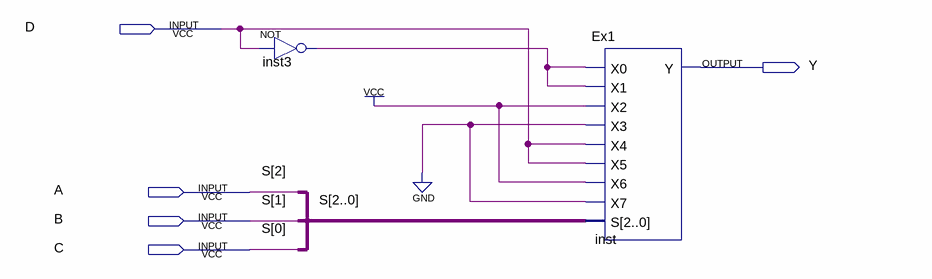
[diagram p0: schematic sheet]
// Quartus schematic MuxSim.bdf as structural Verilog: 2 symbols, 5 pins
module MuxSim (
  input  D,
  input  A,
  input  B,
  input  C,
  output Y
);

  wire inst3_out;

  not inst3 (inst3_out, D);
  Ex1 inst (
    .X0(inst3_out), .X1(inst3_out), .X2(1'b1), .X3(1'b0), .X4(D), .X5(D), .X6(1'b1), .X7(1'b0),
    .S({A, B, C}), .Y(Y));

  // Other names for the same wires on the sheet: S[2:0] = {A, B, C}
endmodule
